# Altium schematic sheet Chargers.SchDoc
size A3; SheetNumber: 1; SheetTotal: 6
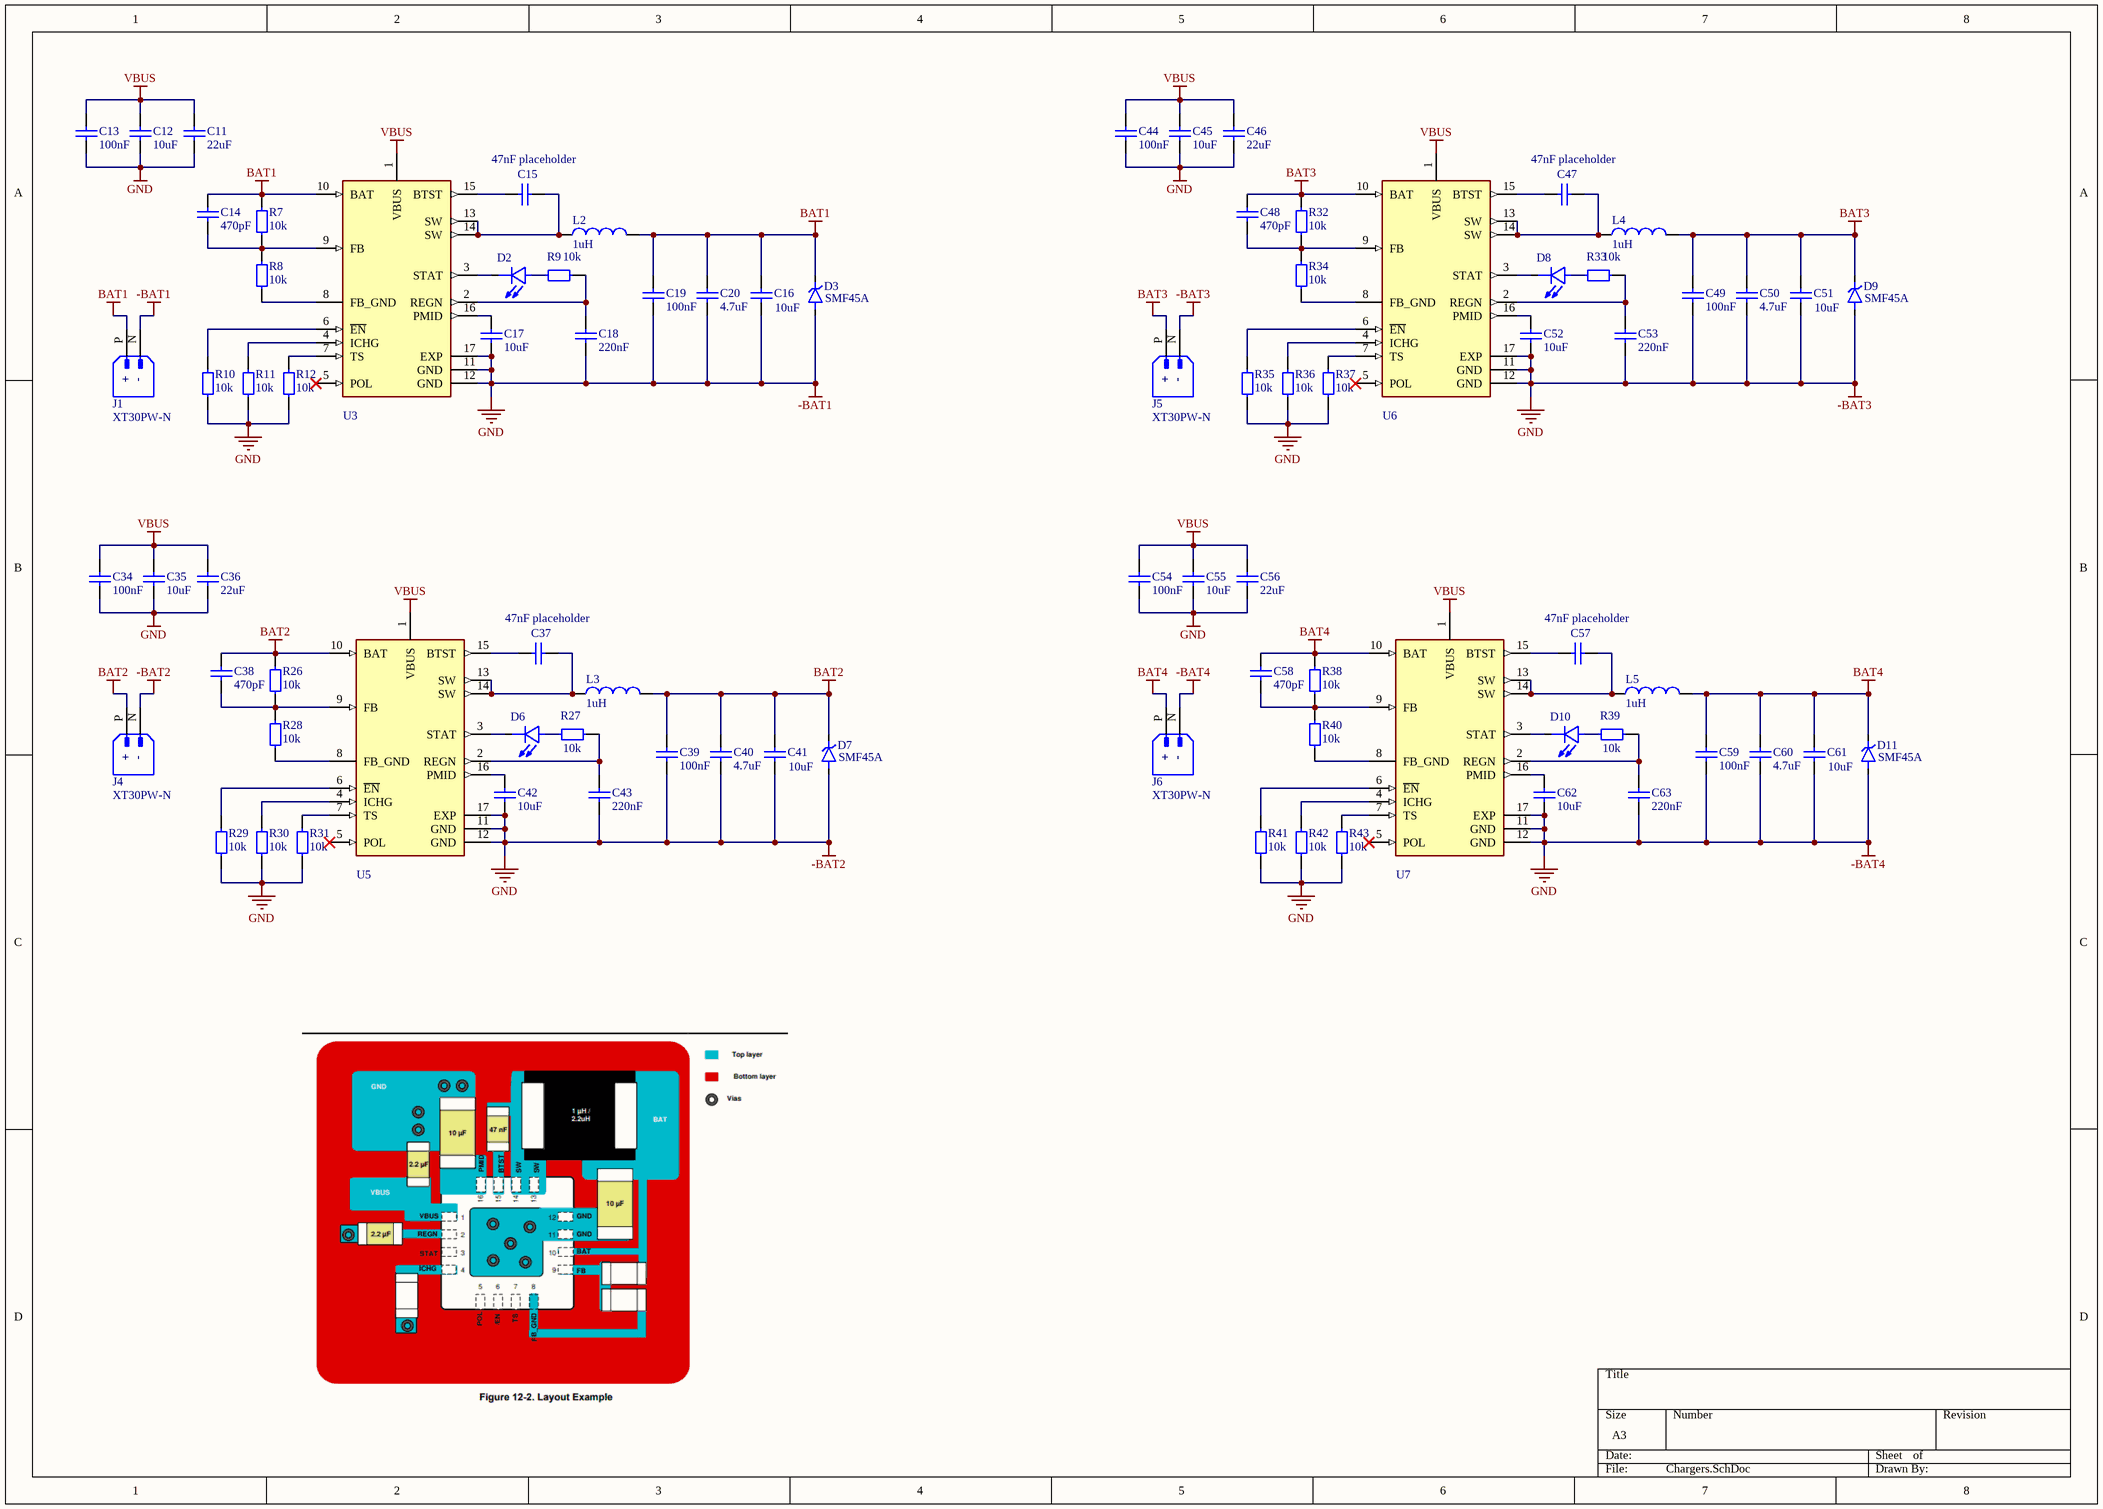
[diagram p0: Chargers.SchDoc]

## Parts
C11  22uF  [1210_CAP]
C12  10uF  [0805_CAP]
C13  100nF  [0603 Capacitor]
C14  470pF  [0603 Capacitor]
C15  47nF placeholder  [0603 Capacitor]
C16  10uF  [0805_CAP]
C17  10uF  [0805_CAP]
C18  220nF  [0603 Capacitor]
C19  100nF  [0603 Capacitor]
C20  4.7uF  [0805_CAP]
C34  100nF  [0603 Capacitor]
C35  10uF  [0805_CAP]
C36  22uF  [1210_CAP]
C37  47nF placeholder  [0603 Capacitor]
C38  470pF  [0603 Capacitor]
C39  100nF  [0603 Capacitor]
C40  4.7uF  [0805_CAP]
C41  10uF  [0805_CAP]
C42  10uF  [0805_CAP]
C43  220nF  [0603 Capacitor]
C44  100nF  [0603 Capacitor]
C45  10uF  [0805_CAP]
C46  22uF  [1210_CAP]
C47  47nF placeholder  [0603 Capacitor]
C48  470pF  [0603 Capacitor]
C49  100nF  [0603 Capacitor]
C50  4.7uF  [0805_CAP]
C51  10uF  [0805_CAP]
C52  10uF  [0805_CAP]
C53  220nF  [0603 Capacitor]
C54  100nF  [0603 Capacitor]
C55  10uF  [0805_CAP]
C56  22uF  [1210_CAP]
C57  47nF placeholder  [0603 Capacitor]
C58  470pF  [0603 Capacitor]
C59  100nF  [0603 Capacitor]
C60  4.7uF  [0805_CAP]
C61  10uF  [0805_CAP]
C62  10uF  [0805_CAP]
C63  220nF  [0603 Capacitor]
D2  LTST-C190KGKT  [LED 0603]  (value not drawn)
D3  SMF45A  [SOD3718X102N]
D6  LTST-C190KGKT  [LED 0603]  (value not drawn)
D7  SMF45A  [SOD3718X102N]
D8  LTST-C190KGKT  [LED 0603]  (value not drawn)
D9  SMF45A  [SOD3718X102N]
D10  LTST-C190KGKT  [LED 0603]  (value not drawn)
D11  SMF45A  [SOD3718X102N]
J1  XT30PW-N  [AMASS_XT30UPB-M]
J4  XT30PW-N  [AMASS_XT30UPB-M]
J5  XT30PW-N  [AMASS_XT30UPB-M]
J6  XT30PW-N  [AMASS_XT30UPB-M]
L2  value 1uH  [HPPC05030]  (hidden comment: HPPC05030-1R0M-Q8)
L3  value 1uH  [HPPC05030]  (hidden comment: HPPC05030-1R0M-Q8)
L4  value 1uH  [HPPC05030]  (hidden comment: HPPC05030-1R0M-Q8)
L5  value 1uH  [HPPC05030]  (hidden comment: HPPC05030-1R0M-Q8)
R7  10k  [0603 Resistor]
R8  10k  [0603 Resistor]
R9  10k  [0603 Resistor]
R10  10k  [0603 Resistor]
R11  10k  [0603 Resistor]
R12  10k  [0603 Resistor]
R26  10k  [0603 Resistor]
R27  10k  [0603 Resistor]
R28  10k  [0603 Resistor]
R29  10k  [0603 Resistor]
R30  10k  [0603 Resistor]
R31  10k  [0603 Resistor]
R32  10k  [0603 Resistor]
R33  10k  [0603 Resistor]
R34  10k  [0603 Resistor]
R35  10k  [0603 Resistor]
R36  10k  [0603 Resistor]
R37  10k  [0603 Resistor]
R38  10k  [0603 Resistor]
R39  10k  [0603 Resistor]
R40  10k  [0603 Resistor]
R41  10k  [0603 Resistor]
R42  10k  [0603 Resistor]
R43  10k  [0603 Resistor]
U3  BQ25306RTER  [IC_BQ25306RTER]  (value not drawn)
U5  BQ25306RTER  [IC_BQ25306RTER]  (value not drawn)
U6  BQ25306RTER  [IC_BQ25306RTER]  (value not drawn)
U7  BQ25306RTER  [IC_BQ25306RTER]  (value not drawn)

## Nets
-BAT1: C11.2 C12.2 C13.2 C16.1 C17.1 C18.1 C19.1 C20.1 C34.2 C35.2 C36.2 C39.1 C40.1 C41.1 C42.1 C43.1 C44.2 C45.2 C46.2 C49.1 C50.1 C51.1 C52.1 C53.1 C54.2 C55.2 C56.2 C59.1 C60.1 C61.1 C62.1 C63.1 D3.A D7.A D9.A D11.A J1.N J4.N J5.N J6.N R10.1(CCW) R11.1(CCW) R12.1(CCW) R29.1(CCW) R30.1(CCW) R31.1(CCW) R35.1(CCW) R36.1(CCW) R37.1(CCW) R41.1(CCW) R42.1(CCW) R43.1(CCW) U3.11(GND) U3.12(GND) U3.17(EXP) U5.11(GND) U5.12(GND) U5.17(EXP) U6.11(GND) U6.12(GND) U6.17(EXP) U7.11(GND) U7.12(GND) U7.17(EXP)  [also labelled -BAT2, -BAT3, -BAT4, GND]
BAT1: C14.2 C16.2 C19.2 C20.2 D3.C(K1) J1.P(+) L2.2 R7.2(CW) U3.10(BAT)
BAT2: C38.2 C39.2 C40.2 C41.2 D7.C(K1) J4.P(+) L3.2 R26.2(CW) U5.10(BAT)
BAT3: C48.2 C49.2 C50.2 C51.2 D9.C(K1) J5.P(+) L4.2 R32.2(CW) U6.10(BAT)
BAT4: C58.2 C59.2 C60.2 C61.2 D11.C(K1) J6.P(+) L5.2 R38.2(CW) U7.10(BAT)
VBUS: C11.1 C12.1 C13.1 C34.1 C35.1 C36.1 C44.1 C45.1 C46.1 C54.1 C55.1 C56.1 U3.1(VBUS) U5.1(VBUS) U6.1(VBUS) U7.1(VBUS)
NetC14_1: C14.1 R7.1(CCW) R8.2(CW) U3.9(FB)
NetC15_1: C15.1 L2.1 U3.13(SW) U3.14(SW)
NetC15_2: C15.2 U3.15(BTST)
NetC17_2: C17.2 U3.16(PMID)
NetC18_2: C18.2 R9.1(CCW) U3.2(REGN)
NetC37_1: C37.1 L3.1 U5.13(SW) U5.14(SW)
NetC37_2: C37.2 U5.15(BTST)
NetC38_1: C38.1 R26.1(CCW) R28.2(CW) U5.9(FB)
NetC42_2: C42.2 U5.16(PMID)
NetC43_2: C43.2 R27.1(CCW) U5.2(REGN)
NetC47_1: C47.1 L4.1 U6.13(SW) U6.14(SW)
NetC47_2: C47.2 U6.15(BTST)
NetC48_1: C48.1 R32.1(CCW) R34.2(CW) U6.9(FB)
NetC52_2: C52.2 U6.16(PMID)
NetC53_2: C53.2 R33.1(CCW) U6.2(REGN)
NetC57_1: C57.1 L5.1 U7.13(SW) U7.14(SW)
NetC57_2: C57.2 U7.15(BTST)
NetC58_1: C58.1 R38.1(CCW) R40.2(CW) U7.9(FB)
NetC62_2: C62.2 U7.16(PMID)
NetC63_2: C63.2 R39.1(CCW) U7.2(REGN)
NetD2_1: D2.1(A) R9.2(CW)
NetD2_2: D2.2(C) U3.3(STAT)
NetD6_1: D6.1(A) R27.2(CW)
NetD6_2: D6.2(C) U5.3(STAT)
NetD8_1: D8.1(A) R33.2(CW)
NetD8_2: D8.2(C) U6.3(STAT)
NetD10_1: D10.1(A) R39.2(CW)
NetD10_2: D10.2(C) U7.3(STAT)
NetR8_1: R8.1(CCW) U3.8(FB_GND)
NetR10_2: R10.2(CW) U3.6(~{EN})
NetR11_2: R11.2(CW) U3.4(ICHG)
NetR12_2: R12.2(CW) U3.7(TS)
NetR28_1: R28.1(CCW) U5.8(FB_GND)
NetR29_2: R29.2(CW) U5.6(~{EN})
NetR30_2: R30.2(CW) U5.4(ICHG)
NetR31_2: R31.2(CW) U5.7(TS)
NetR34_1: R34.1(CCW) U6.8(FB_GND)
NetR35_2: R35.2(CW) U6.6(~{EN})
NetR36_2: R36.2(CW) U6.4(ICHG)
NetR37_2: R37.2(CW) U6.7(TS)
NetR40_1: R40.1(CCW) U7.8(FB_GND)
NetR41_2: R41.2(CW) U7.6(~{EN})
NetR42_2: R42.2(CW) U7.4(ICHG)
NetR43_2: R43.2(CW) U7.7(TS)

Not connected (* = marked no-connect by the designer): U3 5(POL)*; U5 5(POL)*; U6 5(POL)*; U7 5(POL)*

## Notes on the sheet
- (in symbol XT30PW-N) -

## Library data of the parts
C11 C36 C46 C56 = Capacitor 22uF 1210: 22uF 50V 1210
C12 C16 C17 C35 C41 C42 C45 C51 C52 C55 C61 C62 = Capacitor 10uF 0805: 10uF 50V 0805
C13 C19 C34 C39 C44 C49 C54 C59 = Capacitor 100nF 0603: 100nF 50V 0603
C14 C38 C48 C58 = Capacitor 470pF 0603: 470pF 50V 0603
C15 C37 C47 C57 = Capacitor 1nF 0603: 1nF 50V 0603
C18 C43 C53 C63 = Capacitor 220nF 0603: 220nF 50V 0603
C20 C40 C50 C60 = Capacitor 4.7uF 0805: 4.7uF 50V 0805
D2 D6 D8 D10 = LED 0603: 1.6x0.8mm Smd Chip Led Lamp; MF: Kingbright; MP: KPT-1608ZGC; Value: *; SnapEDA_Link: https://www.snapeda.com/parts/KPT-1608ZGC/Kingbright/view-part/?ref=snap; Availability: In Stock; Price: None; Package: 0603 Kingbright; Check_prices: https://www.snapeda.com/parts/KPT-1608ZGC/Kingbright/view-part/?ref=eda
D3 D7 D9 D11 = SMF45A: 1-channel  50V ultra-low-capacitance IEC ESD protection diode; MF: Texas Instruments; MP: TPD1E05U06DPYR; SnapEDA_Link: https://www.snapeda.com/parts/TPD1E05U06DPYR/Texas%20Instruments/view-part/383548/?ref=snap; Value: *; Texas_Instruments-Purchase-URL: https://snapeda.com/shop?store=Texas+Instruments&id=383548; Availability: Good; Price: None; Mouser-Purchase-URL: https://snapeda.com/shop?store=Mouser&id=383548; Package: X1SON-2 Texas Instruments; DigiKey-Purchase-URL: https://snapeda.com/shop?store=DigiKey&id=383548
J1 J4-J6 = XT30PW-N: Socket; DC supply; XT30; male; PIN: 2; on PCBs; THT; straight, Colour: yellow; MF: AMASS; MP: XT30PW-M; SnapEDA_Link: https://www.snapeda.com/parts/XT30PW-M/AMASS/view-part/?ref=snap; Package: None; Value: *; Check_prices: https://www.snapeda.com/parts/XT30PW-M/AMASS/view-part/?ref=eda
L2-L5 = 1uH 9A: 1uH 9A  8.9mΩ
R7-R12 R26-R43 = Resistor 10k 0603: 10k 0603
U3 U5-U7 = BQ25306RTER: TI Standalone 17-V, 3A 1-2 cell buck battery charger; MF: Texas Instruments; SnapEDA_Link: https://www.snapeda.com/parts/BQ25306RTER/Texas+Instruments/view-part/?ref=snap; Package: WFQFN-16 Texas Instruments; Value: *; MP: BQ25306RTER; Check_prices: https://www.snapeda.com/parts/BQ25306RTER/Texas+Instruments/view-part/?ref=eda